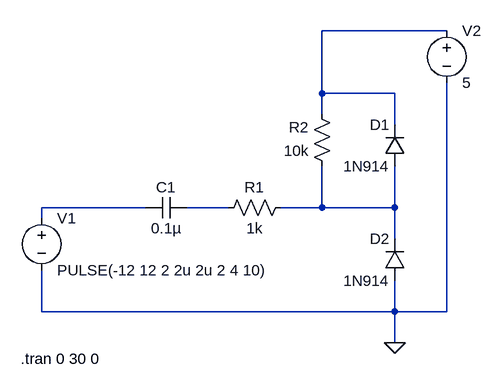
[diagram p0: schematic ArduinoSerialReset.asc]
ArduinoSerialReset.asc, the LTspice schematic file:
Version 4.1
SHEET 1 880 680
WIRE 544 -160 352 -160
WIRE 352 -64 352 -160
WIRE 464 -64 352 -64
WIRE 352 -32 352 -64
WIRE 464 -16 464 -64
WIRE 80 112 -80 112
WIRE 208 112 144 112
WIRE 352 112 352 48
WIRE 352 112 288 112
WIRE 464 112 464 48
WIRE 464 112 352 112
WIRE -80 128 -80 112
WIRE 464 160 464 112
WIRE -80 272 -80 208
WIRE 464 272 464 224
WIRE 464 272 -80 272
WIRE 544 272 544 -80
WIRE 544 272 464 272
WIRE 464 320 464 272
FLAG 464 320 0
SYMBOL voltage -80 112 R0
WINDOW 123 0 0 Left 0
WINDOW 39 0 0 Left 0
SYMATTR InstName V1
SYMATTR Value PULSE(-12 12 2 2u 2u 2 4 10)
SYMBOL voltage 544 -176 R0
WINDOW 123 0 0 Left 0
WINDOW 39 0 0 Left 0
SYMATTR InstName V2
SYMATTR Value 5
SYMBOL res 304 96 R90
WINDOW 0 0 56 VBottom 2
WINDOW 3 32 56 VTop 2
SYMATTR InstName R1
SYMATTR Value 1k
SYMBOL res 368 64 R180
WINDOW 0 36 76 Left 2
WINDOW 3 36 40 Left 2
SYMATTR InstName R2
SYMATTR Value 10k
SYMBOL cap 144 96 R90
WINDOW 0 0 32 VBottom 2
WINDOW 3 32 32 VTop 2
SYMATTR InstName C1
SYMATTR Value 0.1µ
SYMBOL diode 480 48 R180
WINDOW 0 24 64 Left 2
WINDOW 3 24 0 Left 2
SYMATTR InstName D1
SYMATTR Value 1N914
SYMBOL diode 480 224 R180
WINDOW 0 24 64 Left 2
WINDOW 3 24 0 Left 2
SYMATTR InstName D2
SYMATTR Value 1N914
TEXT -112 344 Left 2 !.tran 0 30 0

The netlist it stands for:
* ArduinoSerialReset.asc
V1 N002 0 PULSE(-12 12 2 2u 2u 2 4 10)
V2 N001 0 5
R1 N004 N003 1k
R2 N004 N001 10k
C1 N003 N002 0.1µ
D1 N004 N001 1N914
D2 0 N004 1N914
.model D D
.lib standard.dio
.tran 0 30 0
.backanno
.end